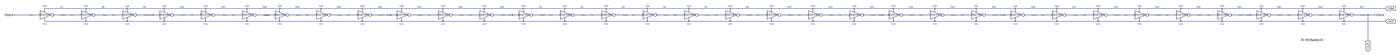
[diagram p0: schematic s_clock.asc, whole sheet]
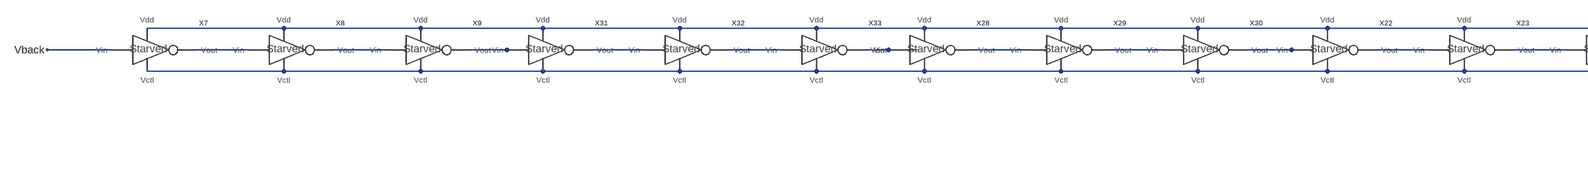
[diagram p1: schematic s_clock.asc, part, row 1 of 1, column 1 of 3]
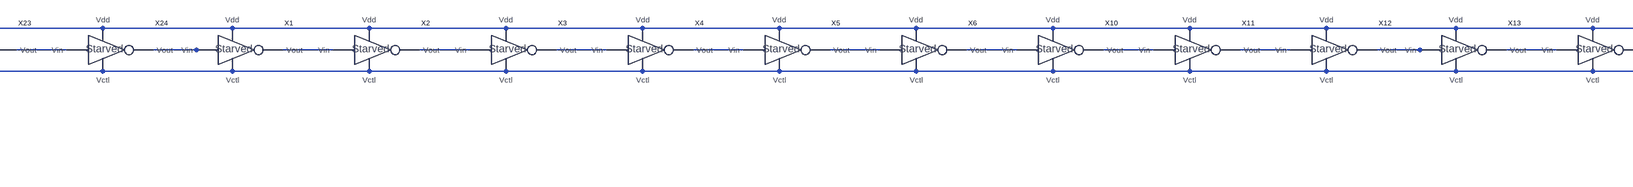
[diagram p2: schematic s_clock.asc, part, row 1 of 1, column 2 of 3]
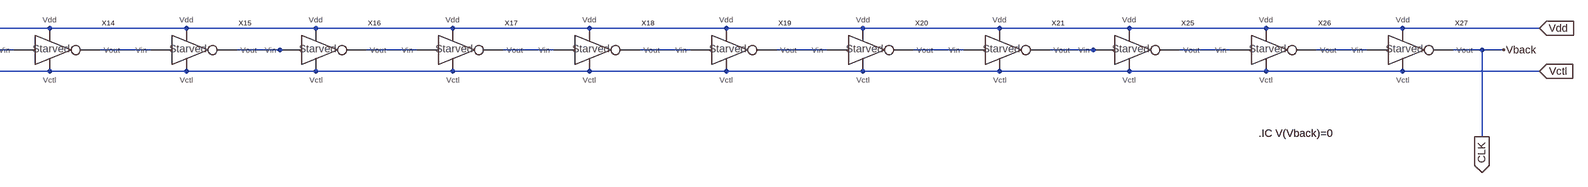
[diagram p3: schematic s_clock.asc, part, row 1 of 1, column 3 of 3]
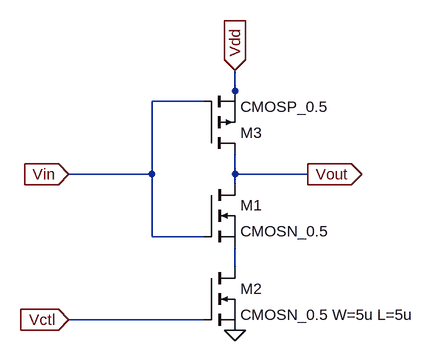
[diagram p4: sub-circuit s_starv_current_inv.asc]
s_clock.asc, the LTspice schematic file:
Version 4
SHEET 1 6728 1060
WIRE -2928 160 -3232 160
WIRE -2624 160 -2928 160
WIRE -2352 160 -2624 160
WIRE -2048 160 -2352 160
WIRE -1744 160 -2048 160
WIRE -1504 160 -1744 160
WIRE -1200 160 -1504 160
WIRE -896 160 -1200 160
WIRE -608 160 -896 160
WIRE -304 160 -608 160
WIRE 0 160 -304 160
WIRE 288 160 0 160
WIRE 592 160 288 160
WIRE 896 160 592 160
WIRE 1200 160 896 160
WIRE 1504 160 1200 160
WIRE 1808 160 1504 160
WIRE 2112 160 1808 160
WIRE 2416 160 2112 160
WIRE 2720 160 2416 160
WIRE 3008 160 2720 160
WIRE 3312 160 3008 160
WIRE 3616 160 3312 160
WIRE 3904 160 3616 160
WIRE 4208 160 3904 160
WIRE 4512 160 4208 160
WIRE 4816 160 4512 160
WIRE 5120 160 4816 160
WIRE 5424 160 5120 160
WIRE 5712 160 5424 160
WIRE 6016 160 5712 160
WIRE 6320 160 6016 160
WIRE 6624 160 6320 160
WIRE -3312 208 -3696 208
WIRE -3008 208 -3120 208
WIRE -2704 208 -2816 208
WIRE -2432 208 -2512 208
WIRE -2400 208 -2432 208
WIRE -2128 208 -2240 208
WIRE -1824 208 -1936 208
WIRE -1584 208 -1632 208
WIRE -1520 208 -1584 208
WIRE -1280 208 -1392 208
WIRE -976 208 -1088 208
WIRE -688 208 -784 208
WIRE -672 208 -688 208
WIRE -384 208 -496 208
WIRE -80 208 -192 208
WIRE 208 208 112 208
WIRE 224 208 208 208
WIRE 512 208 400 208
WIRE 816 208 704 208
WIRE 1120 208 1008 208
WIRE 1424 208 1312 208
WIRE 1728 208 1616 208
WIRE 2032 208 1920 208
WIRE 2336 208 2224 208
WIRE 2640 208 2528 208
WIRE 2928 208 2832 208
WIRE 2944 208 2928 208
WIRE 3232 208 3120 208
WIRE 3536 208 3424 208
WIRE 3824 208 3728 208
WIRE 3840 208 3824 208
WIRE 4128 208 4016 208
WIRE 4432 208 4320 208
WIRE 4736 208 4624 208
WIRE 5040 208 4928 208
WIRE 5344 208 5232 208
WIRE 5632 208 5536 208
WIRE 5648 208 5632 208
WIRE 5936 208 5824 208
WIRE 6240 208 6128 208
WIRE 6496 208 6432 208
WIRE 6544 208 6496 208
WIRE -2928 256 -3232 256
WIRE -2624 256 -2928 256
WIRE -2352 256 -2624 256
WIRE -2048 256 -2352 256
WIRE -1744 256 -2048 256
WIRE -1504 256 -1744 256
WIRE -1200 256 -1504 256
WIRE -896 256 -1200 256
WIRE -608 256 -896 256
WIRE -304 256 -608 256
WIRE 0 256 -304 256
WIRE 288 256 0 256
WIRE 592 256 288 256
WIRE 896 256 592 256
WIRE 1200 256 896 256
WIRE 1504 256 1200 256
WIRE 1808 256 1504 256
WIRE 2112 256 1808 256
WIRE 2416 256 2112 256
WIRE 2720 256 2416 256
WIRE 3008 256 2720 256
WIRE 3312 256 3008 256
WIRE 3616 256 3312 256
WIRE 3904 256 3616 256
WIRE 4208 256 3904 256
WIRE 4512 256 4208 256
WIRE 4816 256 4512 256
WIRE 5120 256 4816 256
WIRE 5424 256 5120 256
WIRE 5712 256 5424 256
WIRE 6016 256 5712 256
WIRE 6320 256 6016 256
WIRE 6624 256 6320 256
WIRE 6496 432 6496 208
FLAG -3696 208 Vback
FLAG 6544 208 Vback
FLAG 6496 432 CLK
IOPIN 6496 432 Out
FLAG 6624 160 Vdd
IOPIN 6624 160 In
FLAG 6624 256 Vctl
IOPIN 6624 256 In
SYMBOL s_starv_current_inv 288 208 R0
SYMATTR InstName X1
SYMBOL s_starv_current_inv 592 208 R0
SYMATTR InstName X2
SYMBOL s_starv_current_inv 896 208 R0
SYMATTR InstName X3
SYMBOL s_starv_current_inv 1200 208 R0
SYMATTR InstName X4
SYMBOL s_starv_current_inv 1504 208 R0
SYMATTR InstName X5
SYMBOL s_starv_current_inv 1808 208 R0
SYMATTR InstName X6
SYMBOL s_starv_current_inv -3232 208 R0
SYMATTR InstName X7
SYMBOL s_starv_current_inv -2928 208 R0
SYMATTR InstName X8
SYMBOL s_starv_current_inv -2624 208 R0
SYMATTR InstName X9
SYMBOL s_starv_current_inv 2112 208 R0
SYMATTR InstName X10
SYMBOL s_starv_current_inv 2416 208 R0
SYMATTR InstName X11
SYMBOL s_starv_current_inv 2720 208 R0
SYMATTR InstName X12
SYMBOL s_starv_current_inv 3008 208 R0
SYMATTR InstName X13
SYMBOL s_starv_current_inv 3312 208 R0
SYMATTR InstName X14
SYMBOL s_starv_current_inv 3616 208 R0
SYMATTR InstName X15
SYMBOL s_starv_current_inv 3904 208 R0
SYMATTR InstName X16
SYMBOL s_starv_current_inv 4208 208 R0
SYMATTR InstName X17
SYMBOL s_starv_current_inv 4512 208 R0
SYMATTR InstName X18
SYMBOL s_starv_current_inv 4816 208 R0
SYMATTR InstName X19
SYMBOL s_starv_current_inv 5120 208 R0
SYMATTR InstName X20
SYMBOL s_starv_current_inv 5424 208 R0
SYMATTR InstName X21
SYMBOL s_starv_current_inv -608 208 R0
SYMATTR InstName X22
SYMBOL s_starv_current_inv -304 208 R0
SYMATTR InstName X23
SYMBOL s_starv_current_inv 0 208 R0
SYMATTR InstName X24
SYMBOL s_starv_current_inv 5712 208 R0
SYMATTR InstName X25
SYMBOL s_starv_current_inv 6016 208 R0
SYMATTR InstName X26
SYMBOL s_starv_current_inv 6320 208 R0
SYMATTR InstName X27
SYMBOL s_starv_current_inv -1504 208 R0
SYMATTR InstName X28
SYMBOL s_starv_current_inv -1200 208 R0
SYMATTR InstName X29
SYMBOL s_starv_current_inv -896 208 R0
SYMATTR InstName X30
SYMBOL s_starv_current_inv -2352 208 R0
SYMATTR InstName X31
SYMBOL s_starv_current_inv -2048 208 R0
SYMATTR InstName X32
SYMBOL s_starv_current_inv -1744 208 R0
SYMATTR InstName X33
TEXT 6000 424 Left 2 !.IC V(Vback)=0

s_starv_current_inv.asc, the sub-circuit schematic file:
Version 4
SHEET 1 880 680
WIRE 176 -16 176 -48
WIRE 128 0 48 0
WIRE 176 0 176 -16
WIRE 48 112 48 0
WIRE 48 112 -80 112
WIRE 176 112 176 80
WIRE 288 112 176 112
WIRE 176 128 176 112
WIRE 48 208 48 112
WIRE 128 208 48 208
WIRE 176 256 176 224
WIRE 128 336 -80 336
FLAG 176 352 0
FLAG -80 336 Vctl
IOPIN -80 336 In
FLAG -80 112 Vin
IOPIN -80 112 In
FLAG 288 112 Vout
IOPIN 288 112 Out
FLAG 176 -48 Vdd
IOPIN 176 -48 In
SYMBOL nmos 128 128 R0
SYMATTR InstName M1
SYMATTR Value CMOSN_0.5
SYMBOL nmos 128 256 R0
SYMATTR InstName M2
SYMATTR Value CMOSN_0.5 W=5u L=5u
SYMBOL pmos 128 80 M180
SYMATTR InstName M3
SYMATTR Value CMOSP_0.5

The netlist it stands for:
* s_clock.asc
XX1 N013 N012 Vdd Vctl s_starv_current_inv
XX2 N014 N013 Vdd Vctl s_starv_current_inv
XX3 N015 N014 Vdd Vctl s_starv_current_inv
XX4 N016 N015 Vdd Vctl s_starv_current_inv
XX5 N017 N016 Vdd Vctl s_starv_current_inv
XX6 N018 N017 Vdd Vctl s_starv_current_inv
XX7 N001 CLK Vdd Vctl s_starv_current_inv
XX8 N002 N001 Vdd Vctl s_starv_current_inv
XX9 N003 N002 Vdd Vctl s_starv_current_inv
XX10 N019 N018 Vdd Vctl s_starv_current_inv
XX11 N020 N019 Vdd Vctl s_starv_current_inv
XX12 N021 N020 Vdd Vctl s_starv_current_inv
XX13 N022 N021 Vdd Vctl s_starv_current_inv
XX14 N023 N022 Vdd Vctl s_starv_current_inv
XX15 N024 N023 Vdd Vctl s_starv_current_inv
XX16 N025 N024 Vdd Vctl s_starv_current_inv
XX17 N026 N025 Vdd Vctl s_starv_current_inv
XX18 N027 N026 Vdd Vctl s_starv_current_inv
XX19 N028 N027 Vdd Vctl s_starv_current_inv
XX20 N029 N028 Vdd Vctl s_starv_current_inv
XX21 N030 N029 Vdd Vctl s_starv_current_inv
XX22 N010 N009 Vdd Vctl s_starv_current_inv
XX23 N011 N010 Vdd Vctl s_starv_current_inv
XX24 N012 N011 Vdd Vctl s_starv_current_inv
XX25 N031 N030 Vdd Vctl s_starv_current_inv
XX26 N032 N031 Vdd Vctl s_starv_current_inv
XX27 CLK N032 Vdd Vctl s_starv_current_inv
XX28 N007 N006 Vdd Vctl s_starv_current_inv
XX29 N008 N007 Vdd Vctl s_starv_current_inv
XX30 N009 N008 Vdd Vctl s_starv_current_inv
XX31 N004 N003 Vdd Vctl s_starv_current_inv
XX32 N005 N004 Vdd Vctl s_starv_current_inv
XX33 N006 N005 Vdd Vctl s_starv_current_inv

* block symbol definitions
.subckt s_starv_current_inv Vout Vin Vdd Vctl
M1 Vout Vin N001 N001 CMOSN_0.5
M2 N001 Vctl 0 0 CMOSN_0.5 W=5u L=5u
M3 Vout Vin Vdd Vdd CMOSP_0.5
.ends s_starv_current_inv

.model NMOS NMOS
.model PMOS PMOS
.lib standard.mos
.IC V(Vback)=0
.backanno
.end